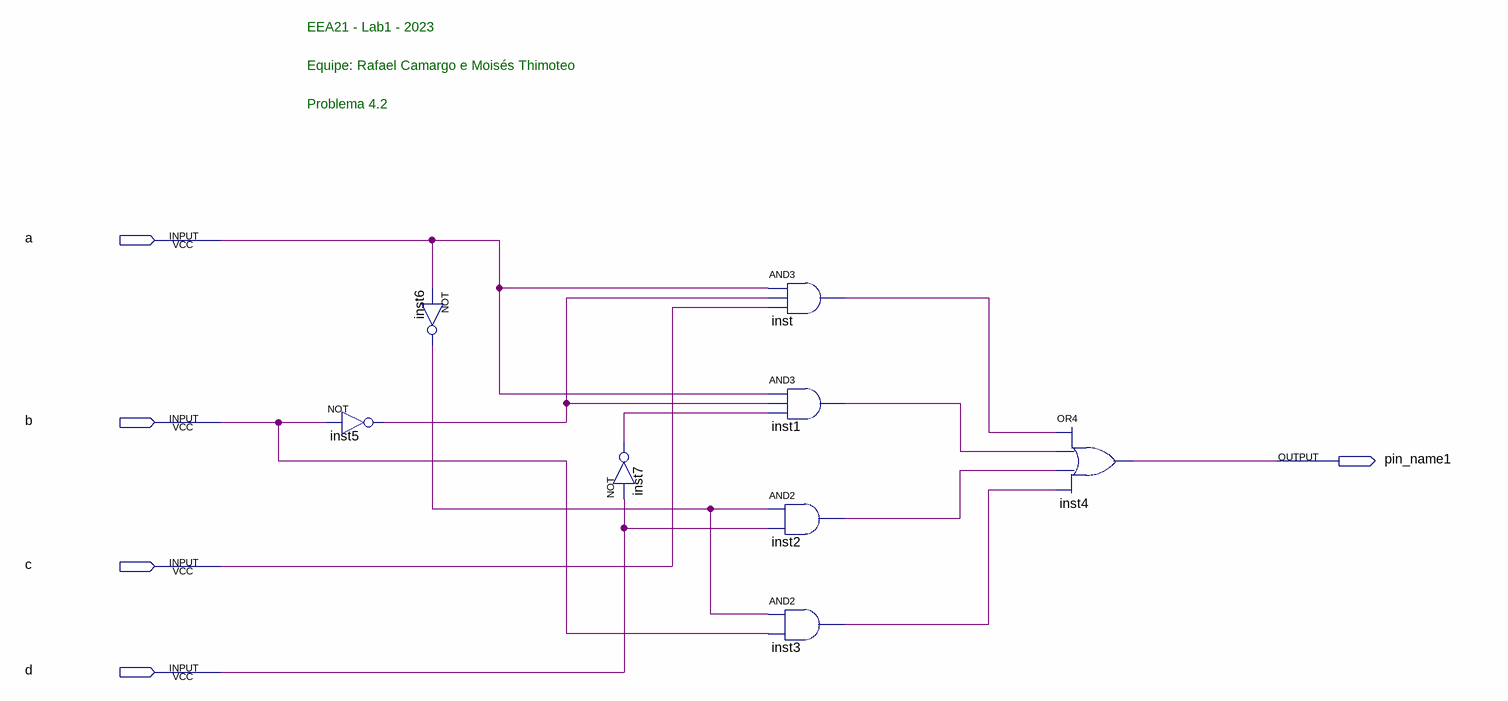
[diagram p0: schematic sheet]
// Quartus schematic Problema42.bdf as structural Verilog: 8 symbols, 5 pins
module Problema42 (
  input  a,
  input  b,
  input  c,
  input  d,
  output pin_name1
);

  wire inst1_out, inst2_out, inst3_out, inst5_out, inst6_out, inst7_out, inst_out;

  not inst5 (inst5_out, b);
  not inst6 (inst6_out, a);
  not inst7 (inst7_out, d);
  and inst (inst_out, a, inst5_out, c);
  and inst1 (inst1_out, a, inst5_out, inst7_out);
  and inst2 (inst2_out, inst6_out, d);
  and inst3 (inst3_out, inst6_out, b);
  or inst4 (pin_name1, inst_out, inst1_out, inst2_out, inst3_out);

  // Notes on the sheet:
  //   EEA21 - Lab1 - 2023                                
  //   Equipe: Rafael Camargo e Moisés Thimoteo                               
  //   Problema 4.2          
endmodule
